# Altium schematic sheet EtherWiz.SchDoc
size A3; SheetNumber: 1; SheetTotal: 3
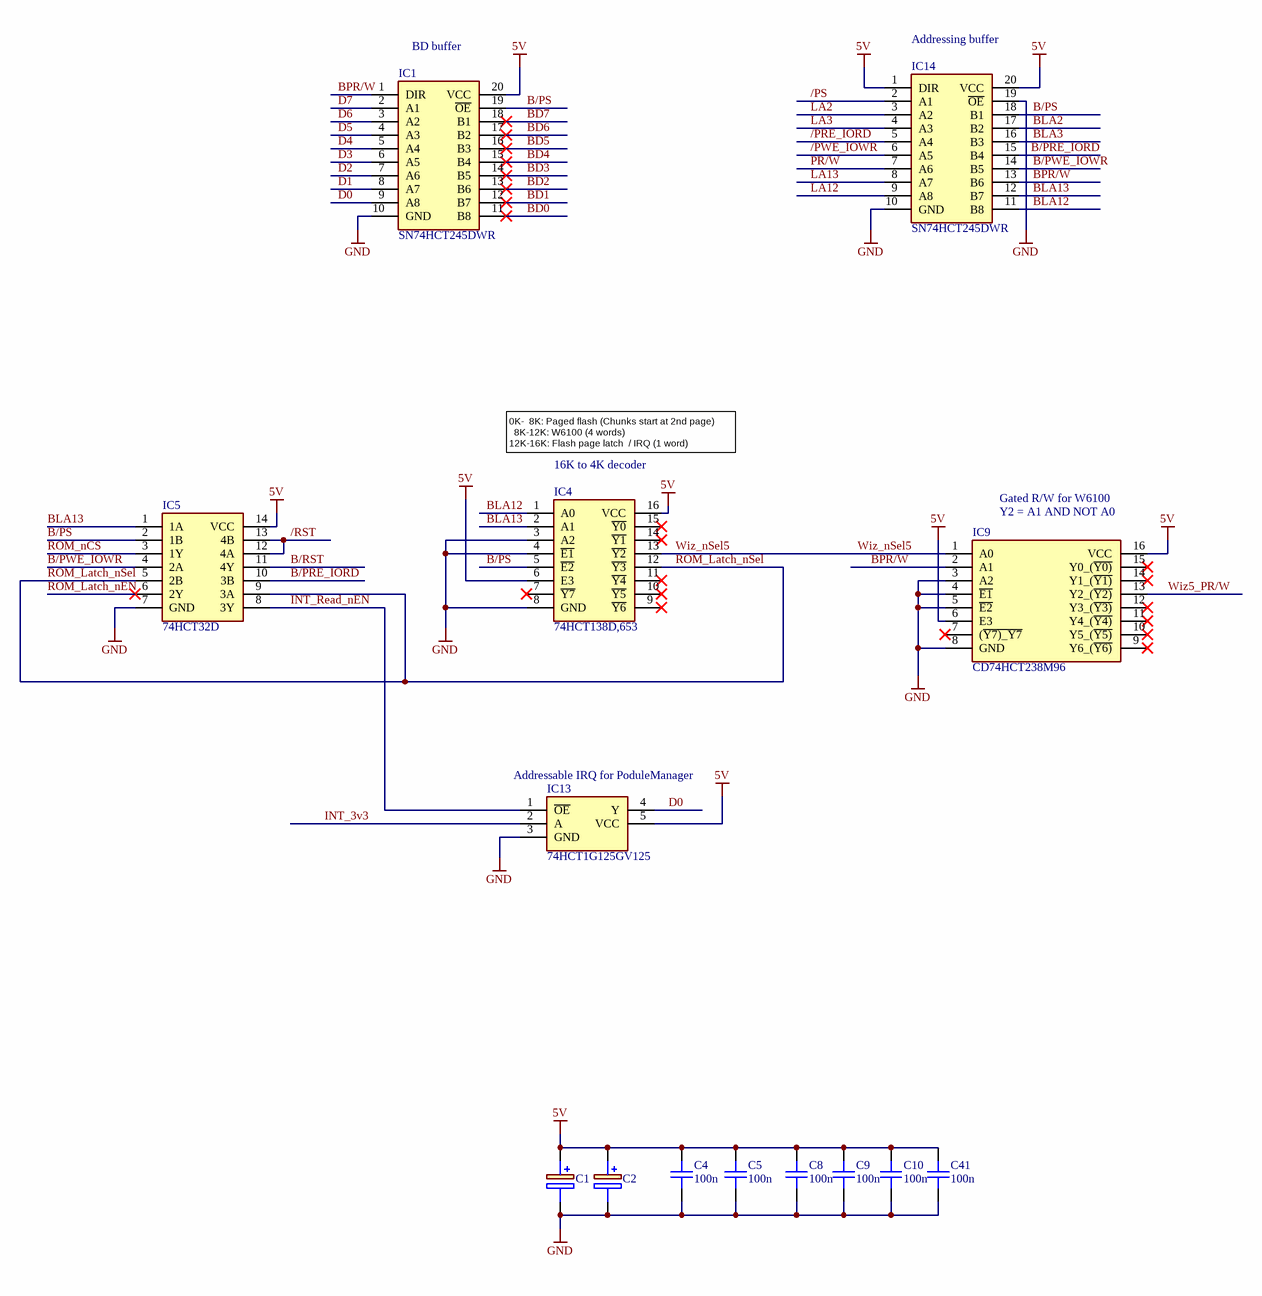
[diagram p0: EtherWiz.SchDoc]

## Parts
C1  EEE-HA1C470AP  [EEE1AA101SP]  (value not drawn)
C2  EEE-HA1C470AP  [EEE1AA101SP]  (value not drawn)
C4  100n  [CAPC1608L]
C5  100n  [CAPC1608L]
C8  100n  [CAPC1608L]
C9  100n  [CAPC1608L]
C10  100n  [CAPC1608L]
C41  100n  [CAPC1608L]
IC1  SN74HCT245DWR  [SOIC127P1030X265-20N]
IC4  74HCT138D,653  [SOIC127P600X175-16N]
IC5  74HCT32D  [SOIC127P600X175-14N]
IC9  CD74HCT238M96  [SOIC127P600X175-16N]
IC13  74HCT1G125GV125  [SOT95P275X110-5N]
IC14  SN74HCT245DWR  [SOIC127P1030X265-20N]

## Nets
5V: C1.1(+) C2.1(+) C4.2 C5.2 C8.2 C9.2 C10.2 C41.2 IC1.20(VCC) IC4.6(E3) IC4.16(VCC) IC5.14(VCC) IC9.6(E3) IC9.16(VCC) IC13.5(VCC) IC14.1(DIR) IC14.20(VCC)
GND: C1.2(-) C2.2(-) C4.1 C5.1 C8.1 C9.1 C10.1 C41.1 IC1.10(GND) IC4.3(A2) IC4.4(~{E1}) IC4.8(GND) IC5.7(GND) IC9.3(A2) IC9.4(~{E1}) IC9.5(~{E2}) IC9.8(GND) IC13.3(GND) IC14.10(GND) IC14.19(~{OE})
/PRE_IORD: IC14.5(A4)
/PS: IC14.2(A1)
/PWE_IOWR: IC14.6(A5)
/RST: IC5.12(4A) IC5.13(4B)
B/PRE_IORD: IC5.10(3B) IC14.15(B4)
B/PS: IC1.19(~{OE}) IC4.5(~{E2}) IC5.2(1B) IC14.18(B1)
B/PWE_IOWR: IC5.4(2A) IC14.14(B5)
B/RST: IC5.11(4Y)
BD0: IC1.11(B8)
BD1: IC1.12(B7)
BD2: IC1.13(B6)
BD3: IC1.14(B5)
BD4: IC1.15(B4)
BD5: IC1.16(B3)
BD6: IC1.17(B2)
BD7: IC1.18(B1)
BLA2: IC14.17(B2)
BLA3: IC14.16(B3)
BLA12: IC4.1(A0) IC14.11(B8)
BLA13: IC4.2(A1) IC5.1(1A) IC14.12(B7)
BPR/W: IC1.1(DIR) IC9.2(A1) IC14.13(B6)
D0: IC1.9(A8) IC13.4(Y)
D1: IC1.8(A7)
D2: IC1.7(A6)
D3: IC1.6(A5)
D4: IC1.5(A4)
D5: IC1.4(A3)
D6: IC1.3(A2)
D7: IC1.2(A1)
INT_3v3: IC13.2(A)
INT_Read_nEN: IC5.8(3Y) IC13.1(~{OE})
LA2: IC14.3(A2)
LA3: IC14.4(A3)
LA12: IC14.9(A8)
LA13: IC14.8(A7)
PR/W: IC14.7(A6)
ROM_Latch_nEN: IC5.6(2Y)
ROM_Latch_nSel: IC4.12(~{Y3}) IC5.5(2B) IC5.9(3A)
ROM_nCS: IC5.3(1Y)
Wiz5_PR/W: IC9.13(Y2_(~{Y2)})
Wiz_nSel5: IC4.13(~{Y2}) IC9.1(A0)

Not connected (* = marked no-connect by the designer): IC4 7(~{Y7})* 9(~{Y6})* 10(~{Y5})* 11(~{Y4})* 14(~{Y1})* 15(~{Y0})*; IC9 7((~{Y7)_Y7})* 9(Y6_(~{Y6)})* 10(Y5_(~{Y5)})* 11(Y4_(~{Y4)})* 12(Y3_(~{Y3)})* 14(Y1_(~{Y1)})* 15(Y0_(~{Y0)})*

## Notes on the sheet
- (near IC1) BD buffer
- (near IC14) Addressing buffer
- 0K-  8K: Paged flash (Chunks start at 2nd page)
  8K-12K: W6100 (4 words)
  12K-16K: Flash page latch  / IRQ (1 word)
- (near IC4) 16K to 4K decoder
- (near IC9) Gated R/W for W6100
- (near IC9) Y2 = A1 AND NOT A0
- (near IC13) Addressable IRQ for PoduleManager
- SIZE
- DIMENSIONS
- TITLE
- VARIANT
- REVISION
- DATE
- A3
- SHEET
- OF
- FILE
- DRAWN BY

## Library data of the parts
C1 C2 = EEE-HA1C470AP: Capacitor Polarised; Manufacturer_Name: Panasonic; Datasheet Link: http://industrial.panasonic.com/cdbs/www-data/pdf/RDE0000/ABA0000C1148.pdf; Height: 7.8mm; Manufacturer_Part_Number: EEE-HA1C470AP; Mouser Part Number: 667-EEE-HA1C470AP; Mouser Price/Stock: https://www.mouser.co.uk/ProductDetail/Panasonic/EEE-HA1C470AP?qs=d1CqaRUMZD%2FL5qU1hDRerg%3D%3D; Arrow Part Number: EEE-HA1C470AP; Arrow Price/Stock: https://www.arrow.com/en/products/eeeha1c470ap/panasonic?utm_currency=USD&region=europe
C4 C5 C8-C10 C41 = CAP_100n_0603_50V_0: CAP 100nF, 0603, 50V, X7R, 10%; Manufacturer1: Samsung; ManuPart1: CL10B104KB8NNNC; ManuPart2: CC0603KRX7R9BB104; Value: 100n; Distributor1: Anglia; Manufacturer2: Yageo; Distributor2: Digikey; Distributor1 Part No: CL10B104KB8NNNC; Distributor2 Part No: 311-1344-2-ND; ComponentLinknURL: *; ComponentLink1Description: ComponentLinknURL1; ComponentLink1URL: https://media.digikey.com/pdf/Data%20Sheets/Samsung%20PDFs/CL_Series_MLCC_ds.pdf; ComponentLink2Description: ComponentLinknURL2; ComponentLink2URL: https://www.yageo.com/upload/media/product/productsearch/datasheet/mlcc/UPY-GPHC_X7R_6.3V-to-50V_18.pdf; Voltage: 50V
IC1 IC14 = SN74HCT245DWR: Integrated Circuit; Manufacturer_Name: Texas Instruments; Datasheet Link: https://datasheet.datasheetarchive.com/originals/distributors/SFDatasheet-6/sf-000131457.pdf; Height: 2.65mm; Manufacturer_Part_Number: SN74HCT245DWR; Mouser Part Number: 595-SN74HCT245DWR; Mouser Price/Stock: https://www.mouser.co.uk/ProductDetail/Texas-Instruments/SN74HCT245DWR?qs=st7IWvlL5%2FhHLMwvvkYTgw%3D%3D; Arrow Part Number: SN74HCT245DWR; Arrow Price/Stock: https://www.arrow.com/en/products/sn74hct245dwr/texas-instruments?region=nac
IC4 = 74HCT138D,653: Integrated Circuit; Manufacturer_Name: Nexperia; Datasheet Link: https://assets.nexperia.com/documents/data-sheet/74HC_HCT138.pdf; Height: 1.75mm; Manufacturer_Part_Number: 74HCT138D,653; Mouser Part Number: 771-74HCT138D-T; Mouser Price/Stock: https://www.mouser.co.uk/ProductDetail/Nexperia/74HCT138D653?qs=P62ublwmbi8MKahyK7iY6g%3D%3D; Arrow Part Number: 74HCT138D,653; Arrow Price/Stock: https://www.arrow.com/en/products/74hct138d653/nexperia?region=nac
IC5 = 74HCT32D: Integrated Circuit; Manufacturer_Name: Toshiba; Datasheet Link: https://toshiba.semicon-storage.com/info/docget.jsp?did=37176&prodName=74HCT32D; Height: 1.75mm; Manufacturer_Part_Number: 74HCT32D; Mouser Part Number: N/A; Mouser Price/Stock: https://www.mouser.co.uk/ProductDetail/Toshiba/74HCT32D?qs=j%252B1pi9TdxUZqVZos7uP1Yw%3D%3D; Arrow Part Number: 74HCT32D; Arrow Price/Stock: https://www.arrow.com/en/products/74hct32d/toshiba?region=nac
IC9 = CD74HCT238M96: Integrated Circuit; Manufacturer_Name: Texas Instruments; Datasheet Link: http://www.ti.com/lit/gpn/cd74hct238; Height: 1.75mm; Manufacturer_Part_Number: CD74HCT238M96; Mouser Part Number: 595-CD74HCT238M96; Mouser Price/Stock: https://www.mouser.co.uk/ProductDetail/Texas-Instruments/CD74HCT238M96?qs=xFfolx0DHx1u%2Fks4%2FbIqqQ%3D%3D
IC13 = 74HCT1G125GV125: Integrated Circuit; Manufacturer_Name: Nexperia; Datasheet Link: https://assets.nexperia.com/documents/data-sheet/74HC_HCT1G125.pdf; Height: 1.1mm; Manufacturer_Part_Number: 74HCT1G125GV125